# Altium schematic sheet 07 - Leds - OptoCoupler Input.SchDoc
size A4
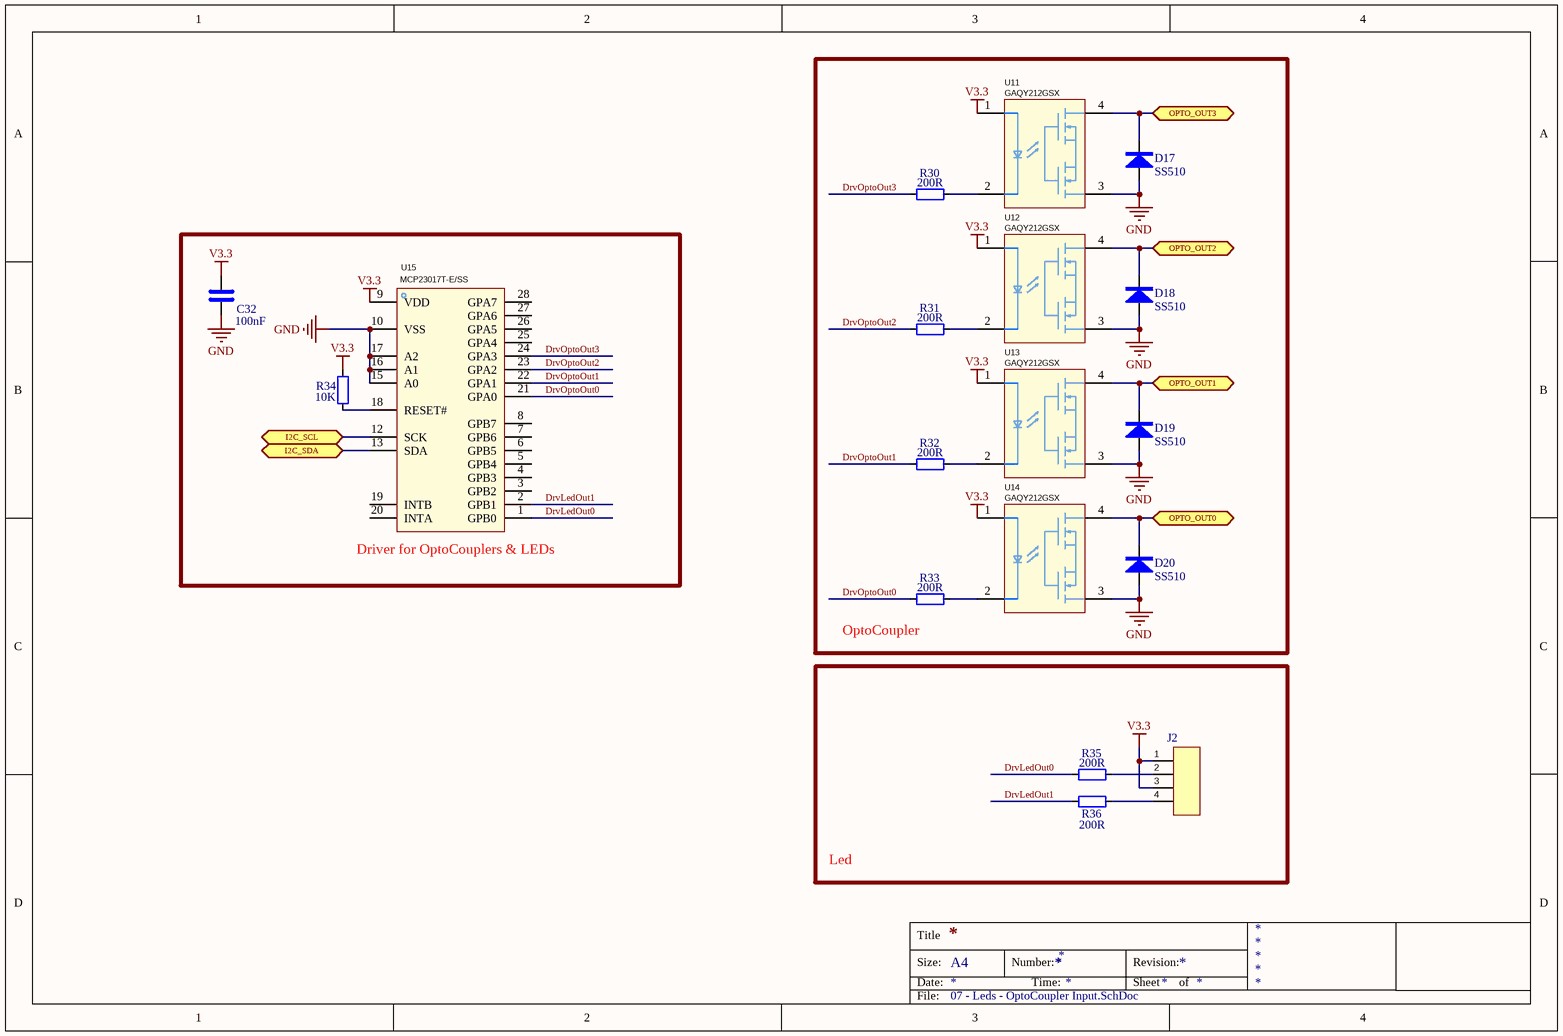
[diagram p0: 07 - Leds - OptoCoupler Input.SchDoc]

## Parts
C32  100nF  [CAP_0603]
D17  value SS510  [S1M-13-F]  (hidden comment: DIODE SCHOTTKY 100V 5A DO214AC)
D18  value SS510  [S1M-13-F]  (hidden comment: DIODE SCHOTTKY 100V 5A DO214AC)
D19  value SS510  [S1M-13-F]  (hidden comment: DIODE SCHOTTKY 100V 5A DO214AC)
D20  value SS510  [S1M-13-F]  (hidden comment: DIODE SCHOTTKY 100V 5A DO214AC)
J2  Conn_01x04_Male  [PinHeader_1x04_P2.54mm_Vertical]  (value not drawn)
R30  value 200R  [RES_0603]  (hidden comment: 200R %5)
R31  value 200R  [RES_0603]  (hidden comment: 200R %5)
R32  value 200R  [RES_0603]  (hidden comment: 200R %5)
R33  value 200R  [RES_0603]  (hidden comment: 200R %5)
R34  value 10K  [RES_0603]  (hidden comment: 10K 1%)
R35  value 200R  [RES_0603]  (hidden comment: 200R %5)
R36  value 200R  [RES_0603]  (hidden comment: 200R %5)
U11  GAQY212GSX  [SOP-4_L4.3-W4.4-P2.54-LS6.8-TR]
U12  GAQY212GSX  [SOP-4_L4.3-W4.4-P2.54-LS6.8-TR]
U13  GAQY212GSX  [SOP-4_L4.3-W4.4-P2.54-LS6.8-TR]
U14  GAQY212GSX  [SOP-4_L4.3-W4.4-P2.54-LS6.8-TR]
U15  MCP23017T-E/SS  [SSOP-28_L10.2-W5.3-P0.65-LS7.8-BL]

## Blocks framed on the sheet
OptoCoupler: D17-D20 R30-R33 U11-U14
Driver for OptoCouplers & LEDs: C32 R34 U15
Led: J2 R35 R36

## Ports
I2C_SCL (bidir), I2C_SDA (bidir), OPTO_OUT0 (bidir), OPTO_OUT1 (bidir), OPTO_OUT2 (bidir), OPTO_OUT3 (bidir)

## Nets
GND: C32.2 D17.2(A) D18.2(A) D19.2(A) D20.2(A) U11.3 U12.3 U13.3 U14.3 U15.10(VSS) U15.15(A0) U15.16(A1) U15.17(A2)
V3.3: C32.1 J2.1(Pin_1) J2.3(Pin_3) R34.2 U11.1 U12.1 U13.1 U14.1 U15.9(VDD)
DrvLedOut0: R35.1 U15.1(GPB0)
DrvLedOut1: R36.1 U15.2(GPB1)
DrvOptoOut0: R33.1 U15.21(GPA0)
DrvOptoOut1: R32.1 U15.22(GPA1)
DrvOptoOut2: R31.1 U15.23(GPA2)
DrvOptoOut3: R30.1 U15.24(GPA3)
I2C_SCL: U15.12(SCK) ; port I2C_SCL
I2C_SDA: U15.13(SDA) ; port I2C_SDA
OPTO_OUT0: D20.1(K) U14.4 ; port OPTO_OUT0
OPTO_OUT1: D19.1(K) U13.4 ; port OPTO_OUT1
OPTO_OUT2: D18.1(K) U12.4 ; port OPTO_OUT2
OPTO_OUT3: D17.1(K) U11.4 ; port OPTO_OUT3
NetJ2_2: J2.2(Pin_2) R35.2
NetJ2_4: J2.4(Pin_4) R36.2
NetR30_2: R30.2 U11.2
NetR31_2: R31.2 U12.2
NetR32_2: R32.2 U13.2
NetR33_2: R33.2 U14.2
NetR34_1: R34.1 U15.18(RESET#)

Not connected (* = marked no-connect by the designer): U15 3(GPB2) 4(GPB3) 5(GPB4) 6(GPB5) 7(GPB6) 8(GPB7) 11(NC) 14(NC) 19(INTB) 20(INTA) 25(GPA4) 26(GPA5) 27(GPA6) 28(GPA7)

## Notes on the sheet
- Title
- Size:
- Date:
- A4
- Number:
- Time:
- Revision:
- Sheet
- of
- File:

## Library data of the parts
C32 = C: pdf: https://www.lcsc.com/datasheet/lcsc_datasheet_2501031500_HRE-CGA0603X7R104K500JT_C6119867.pdf; LCSC PART: C6119867; lcsc link: https://www.lcsc.com/product-detail/Multilayer-Ceramic-Capacitors-MLCC-SMD-SMT_HRE-CGA0603X7R104K500JT_C6119867.html?s_z=n_100nF; JLCPCB: C6119867; Value: 100nF
D17-D20 = DIODE SCHOTTKY 100V 5A DO214AC: MFN: SS510-HT; STOK KOD: HM0953; TYPE: SMD; NAME: DIODE SCHOTTKY 100V 5A DO214AC; Datasheet: https://www.smc-diodes.com/propdf/SK510%20N1113%20REV.A.pdf; lcsc link: https://www.lcsc.com/product-detail/Schottky-Diodes_MDD-Microdiode-Semiconductor-SS510_C65010.html; JLCPCB: C65010; LCSC PART: C65010; pdf: https://www.lcsc.com/datasheet/lcsc_datasheet_2411211954_MDD-Microdiode-Semiconductor-SS510_C65010.pdf
J2 = Conn_01x04_Male: 4P 2.54mm Single Row 1x4P Plugin,P=2.54mm Pin Headers ROHS; JLCPCB: C5116483; Value: Conn_01x04_Male; LCSC PART: C5116483; pdf: https://www.lcsc.com/product-detail/Pin-Headers_ZHOURI-2-54-1-4_C5116483.html?s_z=n_C5116483; lcsc link: https://www.lcsc.com/product-detail/Pin-Headers_ZHOURI-2-54-1-4_C5116483.html?s_z=n_C5116483
R30-R36 = R
  R30-R33 R35 R36: JLCPCB: C2907123; LCSC PART: C2907123; lcsc link: https://www.lcsc.com/product-detail/Chip-Resistor-Surface-Mount_FOJAN-FRC0603J201-TS_C2907123.html
  R34: JLCPCB: C25804; LCSC PART: C25804; lcsc link: https://www.lcsc.com/product-detail/Chip-Resistor-Surface-Mount_UNI-ROYAL-Uniroyal-Elec-0603WAF1002T5E_C25804.html
U11-U14 = GAQY212GSX: 1.32V 60V 180mΩ 1A SOP-4 Solid State Relays (MOS Output) ROHS; Manufacturer: SUPSiC(国晶微半导体); Add into BOM: yes; Isolation Voltage(rms): 2.5kV; Turn-on time: 350us; Turn-off time: 100us; Symbol: GAQY212GSX; Device: GAQY212GSX; LCSC Part Name: 固态继电器; Supplier Part: C19271988; Manufacturer Part: GAQY212GSX; Supplier Footprint: SOP-4; JLCPCB Part Class: Extended Part; Datasheet: https://atta.szlcsc.com/upload/public/pdf/source/20241011/A89ED24ACAE58F7B7A4718E65AC52A14.pdf; Supplier: LCSC; Convert to PCB: yes; Relay Contact Form: -; Load Type: -; Input Forward Voltage: 1.32V; Voltage - Load: 60V; Continuous Load Current: 1A; On Resistance: 180mΩ; LCSC PART: C19271988; lcsc link: https://www.lcsc.com/product-detail/Solid-State-Relays-MOS-Output_SUPSiC-GAQY212GSX_C19271988.html; pdf: https://www.lcsc.com/datasheet/lcsc_datasheet_2411220035_SUPSiC-GAQY212GSX_C19271988.pdf; Value: GAQY212GSX; JLCPCB: C19271988
U15 = MCP23017T-E/SS: 16-Bit I/O Expander with Serial Interface; Manufacturer: MICROCHIP(美国微芯); Add into BOM: yes; Number of I/O: 16; Interrupt Output: With Interrupt Output; Supply Voltage: 1.8V~5.5V; Symbol: MCP23017T-E/SS; Device: MCP23017T-E/SS; LCSC Part Name: 16位带串行接口的I/O扩展器; Supplier Part: C558584; Manufacturer Part: MCP23017T-E/SS; Supplier Footprint: SSOP-28; JLCPCB Part Class: Extended Part; Datasheet: https://atta.szlcsc.com/upload/public/pdf/source/20221209/1BF939F88C2D907BC056D7BF485E3103.pdf; Supplier: LCSC; Convert to PCB: yes; Output Source current: -; Output Sink Current: -; Clock Frequency: -; Operating Temperature: -40℃~+125℃; LCSC PART: C558584; JLCPCB: C558584; lcsc link: https://www.lcsc.com/product-detail/I-O-Expanders_Microchip-Tech-MCP23017T-E-SS_C558584.html?s_z=n_MCP23017; pdf: https://www.lcsc.com/datasheet/lcsc_datasheet_2410122007_Microchip-Tech-MCP23017T-E-SS_C558584.pdf; Value: MCP23017T-E/SS